# Altium schematic sheet PV_MCU_IO.SchDoc
size A
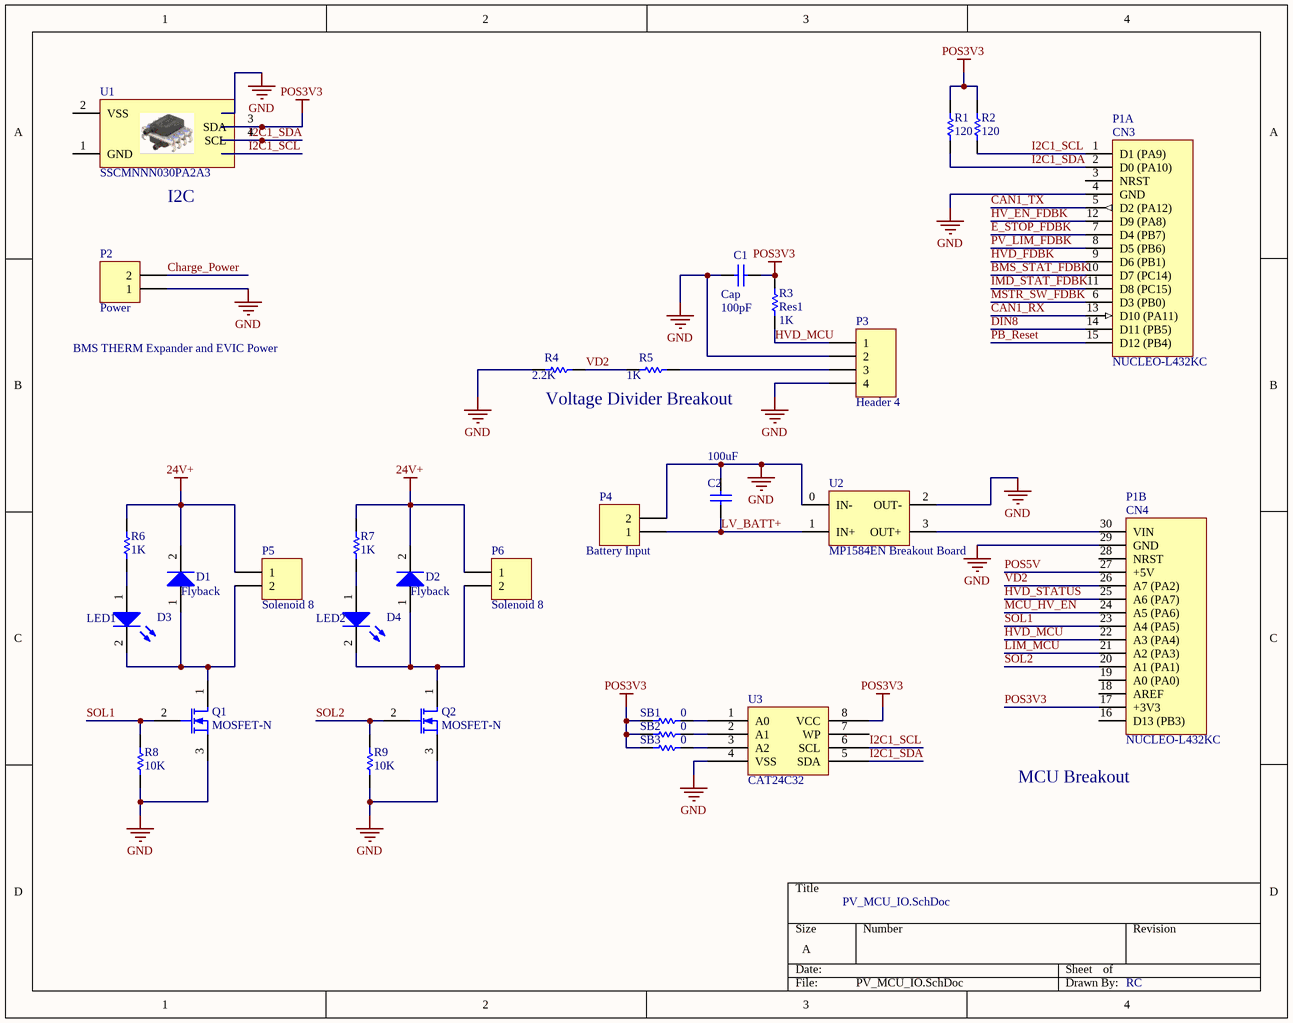
[diagram p0: PV_MCU_IO.SchDoc]

## Parts
C1  Cap  value 100pF  [1206]
C2  value 100uF  [CAPR5-4X5]  (hidden comment: Cap)
D1  Flyback  [1N4007]
D2  Flyback  [1N4007]
D3  LED1  [1206 LED]
D4  LED2  [1206 LED]
P1  NUCLEO-L432KC  [NUCLEO-32]  (parts A,B of 2)
P2  Power  [2POS TERM BLOCK]
P3  Header 4  [4POS TERM BLOCK]
P4  Battery Input  [2POS TERM BLOCK]
P5  Solenoid 8  [2POS TERM BLOCK]
P6  Solenoid 8  [2POS TERM BLOCK]
Q1  MOSFET-N  [SOT-23-3]
Q2  MOSFET-N  [SOT-23-3]
R1  value 120  [1206]  (hidden comment: Res1)
R2  value 120  [1206]  (hidden comment: Res1)
R3  Res1  value 1K  [1206]
R4  value 2.2K  [1206]  (hidden comment: Res1)
R5  value 1K  [1206]  (hidden comment: Res1)
R6  value 1K  [1206]  (hidden comment: Res1)
R7  value 1K  [1206]  (hidden comment: Res1)
R8  value 10K  [1206]  (hidden comment: Res1)
R9  value 10K  [1206]  (hidden comment: Res1)
SB1  value 0  [6-0805_M]  (hidden comment: Res1)
SB2  value 0  [6-0805_M]  (hidden comment: Res1)
SB3  value 0  [6-0805_M]  (hidden comment: Res1)
U1  SSCMNNN030PA2A3  [8-SMT]
U2  MP1584EN Breakout Board  [MP1584EN Breakout]
U3  CAT24C32  [SO8_N]

## Nets
24V+: D1.2(K) D2.2(K) P5.1 P6.1 R6.2 R7.2
GND: C1.2 C2.2 P1.4(GND) P1.29(GND) P2.1 P3.2 P3.4 P4.2 Q1.3(S) Q2.3(S) R4.1 R8.1 R9.1 U2.0(IN-) U2.2(OUT-) U3.4(VSS)
POS3V3: C1.1 P1.17(+3V3) R1.2 R2.2 R3.2 SB1.2 SB2.2 SB3.2 U1.3(SDA) U3.8(VCC)
BMS_STAT_FDBK: P1.10(D7_(PC14))
CAN1_RX: P1.13(D10_(PA11))
CAN1_TX: P1.5(D2_(PA12))
Charge_Power: P2.2
DIN8: P1.14(D11_(PB5))
E_STOP_FDBK: P1.7(D4_(PB7))
HV_EN_FDBK: P1.12(D9_(PA8))
HVD_FDBK: P1.9(D6_(PB1))
HVD_MCU: P1.22(A3_(PA4)) P3.1 R3.1
HVD_STATUS: P1.25(A6_(PA7))
I2C1_SCL: P1.1(D1_(PA9)) R2.1 U3.6(SCL)
I2C1_SDA: P1.2(D0_(PA10)) R1.1 U1.4(SCL) U3.5(SDA)
IMD_STAT_FDBK: P1.11(D8_(PC15))
LIM_MCU: P1.21(A2_(PA3))
LV_BATT+: C2.1 P4.1 U2.1(IN+)
MCU_HV_EN: P1.24(A5_(PA6))
MSTR_SW_FDBK: P1.6(D3_(PB0))
PB_Reset: P1.15(D12_(PB4))
POS5V: P1.27(+5V)
PV_LIM_FDBK: P1.8(D5_(PB6))
SOL1: P1.23(A4_(PA5)) Q1.2(G) R8.2
SOL2: P1.20(A1_(PA1)) Q2.2(G) R9.2
VD2: P1.26(A7_(PA2)) R4.2 R5.1
NetD1_1: D1.1(A) D3.2(K) P5.2 Q1.1(D)
NetD2_1: D2.1(A) D4.2(K) P6.2 Q2.1(D)
NetD3_1: D3.1(A) R6.1
NetD4_1: D4.1(A) R7.1
NetP1_30: P1.30(VIN) U2.3(OUT+)
NetP3_3: P3.3 R5.2
NetSB1_1: SB1.1 U3.1(A0)
NetSB2_1: SB2.1 U3.2(A1)
NetSB3_1: SB3.1 U3.3(A2)

Not connected (* = marked no-connect by the designer): P1 3(NRST) 16(D13_(PB3)) 18(AREF) 19(A0_(PA0)) 28(NRST); U1 1(GND) 2(VSS); U3 7(WP)

## Notes on the sheet
- (near U1) I2C
- BMS THERM Expander and EVIC Power
- Voltage Divider Breakout
- (near P1) MCU Breakout
- PV_MCU_IO.SchDoc
- RC
- (in symbol NUCLEO-L432KC, part A) CN3
- (in symbol NUCLEO-L432KC, part B) CN4

## Library data of the parts
C1 C2 = Cap: Capacitor; Published: 8-Jun-2000; LatestRevisionDate: 17-Jul-2002; LatestRevisionNote: Re-released for DXP Platform.; PackageReference: RAD-0.3; Publisher: Altium Limited; PackageDescription: Radial Cap, Thru-Hole; 2 Leads; 0.3 in Pin Spacing
D1 D2 = Diode: Default Diode; Published: 8-Jun-2000; LatestRevisionDate: 17-Jul-2002; LatestRevisionNote: Re-released for DXP Platform.; PackageVersion: Sep-1996; PackageReference: SMC; Publisher: Altium Limited; PackageDescription: DO-214-AB/SMC; 2 C-Bend Leads; Body 7.9 x 5.9 mm, inc. leads (LxW); Code_JEDEC: DO-214-AB
D3 D4 = LED2: Typical RED, GREEN, YELLOW, AMBER GaAs LED; Published: 8-Jun-2000; LatestRevisionDate: 17-Jul-2002; LatestRevisionNote: Re-released for DXP Platform.; PackageVersion: Feb-2002; PackageReference: 3.2X1.6X1.1; Publisher: Altium Limited; PackageDescription: SM LED; 2 Flat Leads
P1 = NUCLEO-L432KC: STM32L432KC Development Board; ComponentLink1Description: MBED; ComponentLink1URL: https://os.mbed.com/platforms/ST-Nucleo-L432KC/; ComponentLink2Description: Digikey; ComponentLink2URL: https://www.digikey.com/products/en?keywords=NUCLEO-L432KC
P2 P4-P6 = Header 2: Header, 2-Pin; LatestRevisionDate: 17-Jul-2002; LatestRevisionNote: Re-released for DXP Platform.; Publisher: Altium Limited
P3 = Header 4: Header, 4-Pin; LatestRevisionDate: 17-Jul-2002; LatestRevisionNote: Re-released for DXP Platform.; Publisher: Altium Limited
Q1 Q2 = MOSFET-N: N-Channel MOSFET; pin to pad: 1>D 2>G 3>S; Published: 8-Jun-2000; LatestRevisionDate: 17-Jul-2002; LatestRevisionNote: Re-released for DXP Platform.; PackageVersion: 1995/1996; PackageReference: E3; Publisher: Altium Limited; PackageDescription: TO, Flat Index; 3 In-Line, Axial Leads; Body Dia. 4.6mm; Lead Dia. 0.5 mm (max)
R1-R9 SB1-SB3 = Res1: Resistor; Published: 8-Jun-2000; LatestRevisionDate: 17-Jul-2002; LatestRevisionNote: Re-released for DXP Platform.; PackageReference: AXIAL-0.3; Publisher: Altium Limited; PackageDescription: Axial Device, Thru-Hole; 2 Leads; 0.3 in Pin Spacing
U1 = SSCMNNN030PA2A3: Honeywell Digital Pressure Sensor; ComponentLink1Description: Part; ComponentLink1URL: https://www.digikey.com/product-detail/en/honeywell-sensing-and-productivity-solutions/SSCMNNN030PA2A3/480-6407-ND/2416123; ComponentLink2Description: Datasheet; ComponentLink2URL: https://sensing.honeywell.com/index.php?ci_id=151134
U2 = MP1584EN Breakout Board: Buck Converter; ComponentLink1Description: Part; ComponentLink1URL: https://www.amazon.com/eBoot-MP1584EN-Converter-Adjustable-Module/dp/B01MQGMOKI/
U3 = CAT24C32: I2C EEPROM; ComponentLink1Description: Part; ComponentLink1URL: https://www.digikey.com/product-detail/en/on-semiconductor/CAT24C32WI-GT3/CAT24C32WI-GT3CT-ND/1631159; ComponentLink2Description: Datasheet; ComponentLink2URL: http://www.onsemi.com/pub/Collateral/CAT24C32-D.PDF